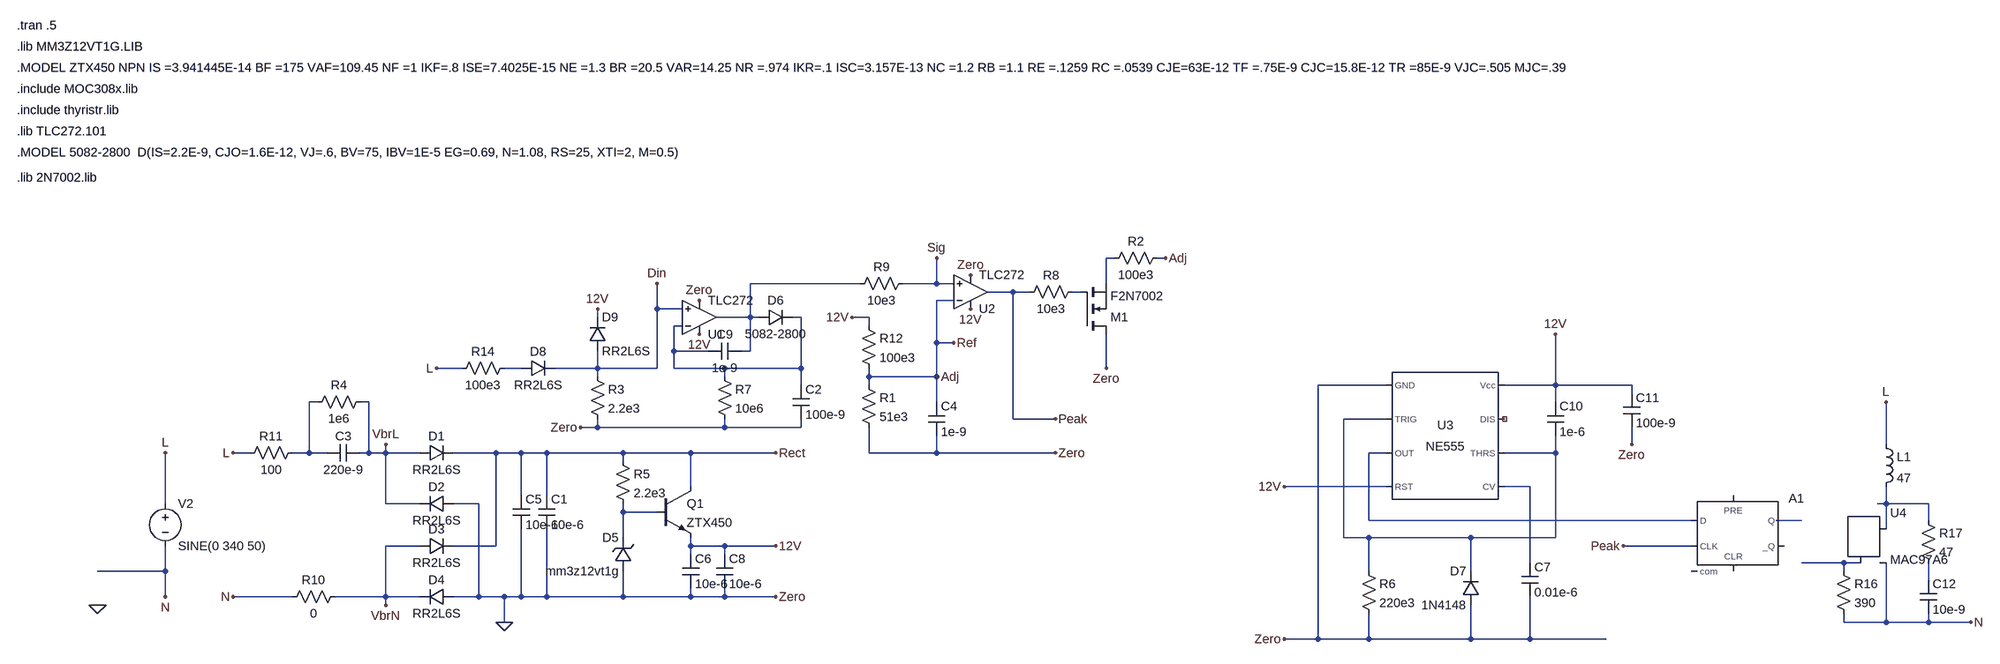
[diagram p0: schematic InrushTimer-2.asc]
InrushTimer-2.asc, the LTspice schematic file:
Version 4
SHEET 1 1936 864
WIRE -96 -560 -112 -560
WIRE 0 -560 -16 -560
WIRE -576 -512 -784 -512
WIRE -432 -512 -432 -560
WIRE -432 -512 -496 -512
WIRE -400 -512 -432 -512
WIRE -112 -512 -112 -560
WIRE -288 -496 -336 -496
WIRE -256 -496 -288 -496
WIRE -160 -496 -176 -496
WIRE -400 -480 -432 -480
WIRE -960 -464 -960 -512
WIRE -912 -464 -960 -464
WIRE -1072 -448 -1072 -464
WIRE -784 -448 -784 -512
WIRE -784 -448 -848 -448
WIRE -768 -448 -784 -448
WIRE -688 -448 -704 -448
WIRE -560 -448 -592 -448
WIRE -912 -432 -928 -432
WIRE -560 -432 -560 -448
WIRE -432 -400 -432 -480
WIRE -400 -400 -432 -400
WIRE -928 -384 -928 -432
WIRE -864 -384 -928 -384
WIRE -784 -384 -784 -448
WIRE -784 -384 -800 -384
WIRE -1328 -352 -1376 -352
WIRE -1216 -352 -1248 -352
WIRE -1072 -352 -1072 -384
WIRE -1072 -352 -1152 -352
WIRE -960 -352 -960 -464
WIRE -960 -352 -1072 -352
WIRE -928 -352 -928 -384
WIRE -832 -352 -928 -352
WIRE -688 -352 -688 -448
WIRE -688 -352 -832 -352
WIRE -112 -352 -112 -416
WIRE -1072 -336 -1072 -352
WIRE -832 -336 -832 -352
WIRE -560 -336 -560 -352
WIRE -432 -336 -432 -400
WIRE -432 -336 -560 -336
WIRE -688 -320 -688 -352
WIRE -560 -320 -560 -336
WIRE 416 -320 288 -320
WIRE 736 -320 736 -416
WIRE 736 -320 640 -320
WIRE 880 -320 736 -320
WIRE 880 -304 880 -320
WIRE -1600 -288 -1616 -288
WIRE -1504 -288 -1520 -288
WIRE -432 -288 -432 -336
WIRE 736 -288 736 -320
WIRE -288 -256 -288 -496
WIRE -208 -256 -288 -256
WIRE 416 -256 336 -256
WIRE -1072 -240 -1072 -256
WIRE -1072 -240 -1104 -240
WIRE -832 -240 -832 -256
WIRE -832 -240 -1072 -240
WIRE -688 -240 -688 -256
WIRE -688 -240 -832 -240
WIRE 880 -208 880 -240
WIRE 1360 -208 1360 -288
WIRE -1728 -192 -1760 -192
WIRE -1616 -192 -1616 -288
WIRE -1616 -192 -1648 -192
WIRE -1584 -192 -1616 -192
WIRE -1504 -192 -1504 -288
WIRE -1504 -192 -1520 -192
WIRE -1472 -192 -1472 -208
WIRE -1472 -192 -1504 -192
WIRE -1408 -192 -1472 -192
WIRE -1264 -192 -1344 -192
WIRE -1216 -192 -1264 -192
WIRE -1168 -192 -1216 -192
WIRE -1024 -192 -1168 -192
WIRE -896 -192 -1024 -192
WIRE -736 -192 -896 -192
WIRE -560 -192 -560 -240
WIRE -432 -192 -432 -224
WIRE -432 -192 -560 -192
WIRE -208 -192 -432 -192
WIRE 416 -192 384 -192
WIRE 736 -192 736 -224
WIRE 736 -192 640 -192
WIRE -1024 -176 -1024 -192
WIRE -896 -128 -896 -192
WIRE 416 -128 224 -128
WIRE 688 -128 640 -128
WIRE -1216 -112 -1216 -192
WIRE -1168 -112 -1168 -192
WIRE -1888 -96 -1888 -192
WIRE -1472 -96 -1472 -192
WIRE -1408 -96 -1472 -96
WIRE -1296 -96 -1344 -96
WIRE 1360 -96 1360 -128
WIRE 1360 -96 1344 -96
WIRE 1440 -96 1360 -96
WIRE -1024 -80 -1024 -96
WIRE -960 -80 -1024 -80
WIRE 384 -64 384 -192
WIRE 992 -64 384 -64
WIRE 1200 -64 1152 -64
WIRE 1440 -64 1440 -96
WIRE 1360 -48 1360 -96
WIRE -1024 -32 -1024 -80
WIRE 336 -32 336 -256
WIRE 384 -32 336 -32
WIRE 576 -32 384 -32
WIRE 736 -32 736 -192
WIRE 736 -32 576 -32
WIRE -1408 -16 -1472 -16
WIRE -1264 -16 -1264 -192
WIRE -1264 -16 -1344 -16
WIRE -896 -16 -896 -32
WIRE -832 -16 -896 -16
WIRE -736 -16 -832 -16
WIRE 992 -16 864 -16
WIRE -896 0 -896 -16
WIRE -832 0 -832 -16
WIRE 688 16 688 -128
WIRE 1280 16 1200 16
WIRE 1312 16 1280 16
WIRE -1888 32 -1888 -16
WIRE -1888 32 -2016 32
WIRE 384 32 384 -32
WIRE 576 32 576 -32
WIRE 1280 32 1280 16
WIRE 1440 48 1440 16
WIRE -1888 80 -1888 32
WIRE -1648 80 -1760 80
WIRE -1472 80 -1472 -16
WIRE -1472 80 -1568 80
WIRE -1408 80 -1472 80
WIRE -1296 80 -1296 -96
WIRE -1296 80 -1344 80
WIRE -1248 80 -1296 80
WIRE -1216 80 -1216 -48
WIRE -1216 80 -1248 80
WIRE -1168 80 -1168 -48
WIRE -1168 80 -1216 80
WIRE -1024 80 -1024 32
WIRE -1024 80 -1168 80
WIRE -896 80 -896 64
WIRE -896 80 -1024 80
WIRE -832 80 -832 64
WIRE -832 80 -896 80
WIRE -736 80 -832 80
WIRE -1472 96 -1472 80
WIRE -1248 128 -1248 80
WIRE 1280 128 1280 112
WIRE 1360 128 1360 16
WIRE 1360 128 1280 128
WIRE 1440 128 1440 112
WIRE 1440 128 1360 128
WIRE 1520 128 1440 128
WIRE 288 160 288 -320
WIRE 288 160 224 160
WIRE 384 160 384 112
WIRE 384 160 288 160
WIRE 576 160 576 96
WIRE 576 160 384 160
WIRE 688 160 688 80
WIRE 688 160 576 160
WIRE 832 160 688 160
FLAG -1760 -192 L
FLAG -1760 80 N
FLAG -1888 -192 L
FLAG -1888 80 N
FLAG -736 -16 12V
FLAG -2016 96 0
FLAG -736 -192 Rect
FLAG -736 80 Zero
FLAG -1472 -208 VbrL
FLAG -1472 96 VbrN
FLAG -1104 -240 Zero
FLAG -960 -512 Din
FLAG -880 -416 12V
FLAG -880 -480 Zero
FLAG -368 -464 12V
FLAG -368 -528 Zero
FLAG -1376 -352 L
FLAG -1248 128 0
FLAG -1072 -464 12V
FLAG -432 -560 Sig
FLAG -400 -400 Ref
FLAG -112 -352 Zero
FLAG 0 -560 Adj
FLAG -208 -192 Zero
FLAG -592 -448 12V
FLAG -432 -336 Adj
FLAG 1520 128 N
FLAG 1360 -288 L
FLAG 224 160 Zero
FLAG 224 -128 12V
FLAG 736 -416 12V
FLAG 880 -208 Zero
FLAG -208 -256 Peak
FLAG 864 -16 Peak
SYMBOL voltage -1888 -112 R0
WINDOW 123 0 0 Left 2
WINDOW 39 0 0 Left 2
SYMATTR InstName V2
SYMATTR Value SINE(0 340 50)
SYMBOL diode -1408 -208 M90
WINDOW 0 0 32 VBottom 2
WINDOW 3 32 32 VTop 2
SYMATTR InstName D1
SYMATTR Value RR2L6S
SYMBOL diode -1408 -32 M90
WINDOW 0 0 32 VBottom 2
WINDOW 3 32 32 VTop 2
SYMATTR InstName D3
SYMATTR Value RR2L6S
SYMBOL diode -1344 -112 R90
WINDOW 0 0 32 VBottom 2
WINDOW 3 32 32 VTop 2
SYMATTR InstName D2
SYMATTR Value RR2L6S
SYMBOL diode -1344 64 R90
WINDOW 0 0 32 VBottom 2
WINDOW 3 32 32 VTop 2
SYMATTR InstName D4
SYMATTR Value RR2L6S
SYMBOL cap -1520 -208 R90
WINDOW 0 0 32 VBottom 2
WINDOW 3 32 32 VTop 2
SYMATTR InstName C3
SYMATTR Value 220e-9
SYMBOL res -1504 -304 R90
WINDOW 0 0 56 VBottom 2
WINDOW 3 32 56 VTop 2
SYMATTR InstName R4
SYMATTR Value 1e6
SYMBOL zener -1008 32 R180
WINDOW 0 24 64 Left 2
WINDOW 3 24 0 Left 2
SYMATTR InstName D5
SYMATTR Value mm3z12vt1g
SYMATTR Prefix X
SYMBOL npn -960 -128 R0
SYMATTR InstName Q1
SYMATTR Value ZTX450
SYMBOL res -1040 -192 R0
SYMATTR InstName R5
SYMATTR Value 2.2e3
SYMBOL res -1552 64 R90
WINDOW 0 0 56 VBottom 2
WINDOW 3 32 56 VTop 2
SYMATTR InstName R10
SYMATTR Value 0
SYMBOL cap -1232 -112 R0
SYMATTR InstName C5
SYMATTR Value 10e-6
SYMBOL cap -912 0 R0
SYMATTR InstName C6
SYMATTR Value 10e-6
SYMBOL cap -848 0 R0
SYMATTR InstName C8
SYMATTR Value 10e-6
SYMBOL res -1088 -352 R0
SYMATTR InstName R3
SYMATTR Value 2.2e3
SYMBOL diode -768 -432 R270
WINDOW 0 32 32 VTop 2
WINDOW 3 0 32 VBottom 2
SYMATTR InstName D6
SYMATTR Value 5082-2800
SYMBOL cap -704 -320 R0
SYMATTR InstName C2
SYMATTR Value 100e-9
SYMBOL Opamps\\opamp2 -880 -384 M180
SYMATTR InstName U1
SYMATTR Value TLC272
SYMBOL Opamps\\opamp2 -368 -432 M180
SYMATTR InstName U2
SYMATTR Value TLC272
SYMBOL res -1632 -208 R90
WINDOW 0 0 56 VBottom 2
WINDOW 3 32 56 VTop 2
SYMATTR InstName R11
SYMATTR Value 100
SYMBOL cap -1184 -112 R0
SYMATTR InstName C1
SYMATTR Value 10e-6
SYMBOL diode -1216 -368 M90
WINDOW 0 0 32 VBottom 2
WINDOW 3 32 32 VTop 2
SYMATTR InstName D8
SYMATTR Value RR2L6S
SYMBOL res -1232 -368 R90
WINDOW 0 0 56 VBottom 2
WINDOW 3 32 56 VTop 2
SYMATTR InstName R14
SYMATTR Value 100e3
SYMBOL diode -1088 -384 M180
WINDOW 0 24 64 Left 2
WINDOW 3 24 0 Left 2
SYMATTR InstName D9
SYMATTR Value RR2L6S
SYMBOL res -480 -528 R90
WINDOW 0 0 56 VBottom 2
WINDOW 3 32 56 VTop 2
SYMATTR InstName R9
SYMATTR Value 10e3
SYMBOL res 0 -576 R90
WINDOW 0 0 56 VBottom 2
WINDOW 3 32 56 VTop 2
SYMATTR InstName R2
SYMATTR Value 100e3
SYMBOL res -160 -512 R90
WINDOW 0 0 56 VBottom 2
WINDOW 3 32 56 VTop 2
SYMATTR InstName R8
SYMATTR Value 10e3
SYMBOL res -576 -448 R0
SYMATTR InstName R12
SYMATTR Value 100e3
SYMBOL nmos -160 -416 M180
SYMATTR InstName M1
SYMATTR Value F2N7002
SYMATTR Prefix X
SYMBOL Misc\\NE555 528 -224 R0
SYMATTR InstName U3
SYMBOL cap 672 16 R0
SYMATTR InstName C7
SYMATTR Value 0.01e-6
SYMATTR SpiceLine V=16
SYMBOL res 368 16 R0
SYMATTR InstName R6
SYMATTR Value 220e3
SYMBOL cap 720 -288 R0
SYMATTR InstName C10
SYMATTR Value 1e-6
SYMATTR SpiceLine V=16
SYMBOL diode 592 96 R180
WINDOW 0 24 64 Left 2
WINDOW 3 24 0 Left 2
SYMATTR InstName D7
SYMATTR Value 1N4148
SYMBOL cap 864 -304 R0
SYMATTR InstName C11
SYMATTR Value 100e-9
SYMBOL misc\\TRIAC 1328 -48 R0
SYMATTR InstName U4
SYMATTR Value MAC97A6
SYMBOL res 1264 16 R0
SYMATTR InstName R16
SYMATTR Value 390
SYMBOL res 1424 -80 R0
SYMATTR InstName R17
SYMATTR Value 47
SYMBOL cap 1424 48 R0
SYMATTR InstName C12
SYMATTR Value 10e-9
SYMBOL ind 1344 -224 R0
SYMATTR InstName L1
SYMATTR Value 47
SYMATTR SpiceLine Rser=4e3
SYMBOL Digital\\dflop 1072 -112 R0
SYMATTR InstName A1
SYMBOL res -576 -336 R0
SYMATTR InstName R1
SYMATTR Value 51e3
SYMBOL res -848 -352 R0
SYMATTR InstName R7
SYMATTR Value 10e6
SYMBOL cap -448 -288 R0
SYMATTR InstName C4
SYMATTR Value 1e-9
SYMBOL cap -800 -400 R90
WINDOW 0 0 32 VBottom 2
WINDOW 3 32 32 VTop 2
SYMATTR InstName C9
SYMATTR Value 1e-9
TEXT -2168 -992 Left 2 !.MODEL ZTX450 NPN IS =3.941445E-14 BF =175 VAF=109.45 NF =1 IKF=.8 ISE=7.4025E-15 NE =1.3 BR =20.5 VAR=14.25 NR =.974 IKR=.1 ISC=3.157E-13 NC =1.2 RB =1.1 RE =.1259 RC =.0539 CJE=63E-12 TF =.75E-9 CJC=15.8E-12 TR =85E-9 VJC=.505 MJC=.39
TEXT -2168 -1032 Left 2 !.lib MM3Z12VT1G.LIB
TEXT -2168 -1072 Left 2 !.tran .5
TEXT -2168 -952 Left 2 !.include MOC308x.lib
TEXT -2168 -912 Left 2 !.include thyristr.lib
TEXT -2168 -872 Left 2 !.lib TLC272.101
TEXT -2168 -832 Left 2 !.MODEL 5082-2800  D(IS=2.2E-9, CJO=1.6E-12, VJ=.6, BV=75, IBV=1E-5 EG=0.69, N=1.08, RS=25, XTI=2, M=0.5)
TEXT -2168 -784 Left 2 !.lib 2N7002.lib

The netlist it stands for:
* InrushTimer-2.asc
V2 L N SINE(0 340 50)
D1 VbrL Rect RR2L6S
D3 VbrN Rect RR2L6S
D2 0 VbrL RR2L6S
D4 0 VbrN RR2L6S
C3 VbrL N006 220e-9
R4 VbrL N006 1e6
XD5 0 N011 mm3z12vt1g  ; pins + -
Q1 Rect N011 12V 0 ZTX450
R5 Rect N011 2.2e3
R10 VbrN N 0
C5 Rect 0 10e-6
C6 12V 0 10e-6
C8 12V 0 10e-6
R3 Din 0 2.2e3
D6 N002 N004 5082-2800
C2 N004 0 100e-9
XU1 Din N004 12V 0 N002 TLC272  ; pins In+ In- V+ V- OUT
XU2 Sig Adj 12V 0 Peak TLC272  ; pins In+ In- V+ V- OUT
R11 N006 L 100
C1 Rect 0 10e-6
D8 N005 Din RR2L6S
R14 N005 L 100e3
D9 Din 12V RR2L6S
R9 Sig N002 10e3
R2 Adj N001 100e3
R8 N003 Peak 10e3
R12 12V Adj 100e3
XM1 0 N003 N001 F2N7002  ; pins D G S
XU3 0 N007 N008 12V N009 N007 NC_01 12V NE555  ; pins GND TRIG OUT RST CV THRS DIS Vcc
C7 N009 0 0.01e-6 V=16
R6 N007 0 220e3
C10 12V N007 1e-6 V=16
D7 0 N007 1N4148
C11 12V 0 100e-9
XU4 N010 N013 N MAC97A6  ; pins MT2 G MT1
R16 N013 N 390
R17 N010 N014 47
C12 N014 N 10e-9
L1 L N010 47 Rser=4e3
A1 N008 0 Peak 0 0 0 N012 0 DFLOP
R1 Adj 0 51e3
R7 N004 0 10e6
C4 Adj 0 1e-9
C9 N002 N004 1e-9
.model D D
.lib standard.dio
.model NPN NPN
.model PNP PNP
.lib standard.bjt
.MODEL ZTX450 NPN IS =3.941445E-14 BF =175 VAF=109.45 NF =1 IKF=.8 ISE=7.4025E-15 NE =1.3 BR =20.5 VAR=14.25 NR =.974 IKR=.1 ISC=3.157E-13 NC =1.2 RB =1.1 RE =.1259 RC =.0539 CJE=63E-12 TF =.75E-9 CJC=15.8E-12 TR =85E-9 VJC=.505 MJC=.39
.lib MM3Z12VT1G.LIB
.tran .5
.include MOC308x.lib
.include thyristr.lib
.lib TLC272.101
.MODEL 5082-2800  D(IS=2.2E-9, CJO=1.6E-12, VJ=.6, BV=75, IBV=1E-5 EG=0.69, N=1.08, RS=25, XTI=2, M=0.5)
.lib 2N7002.lib
.lib NE555.sub
.backanno
.end